# EAGLE design Iridium_9603_Lite_USB (EAGLE 7.6.0)
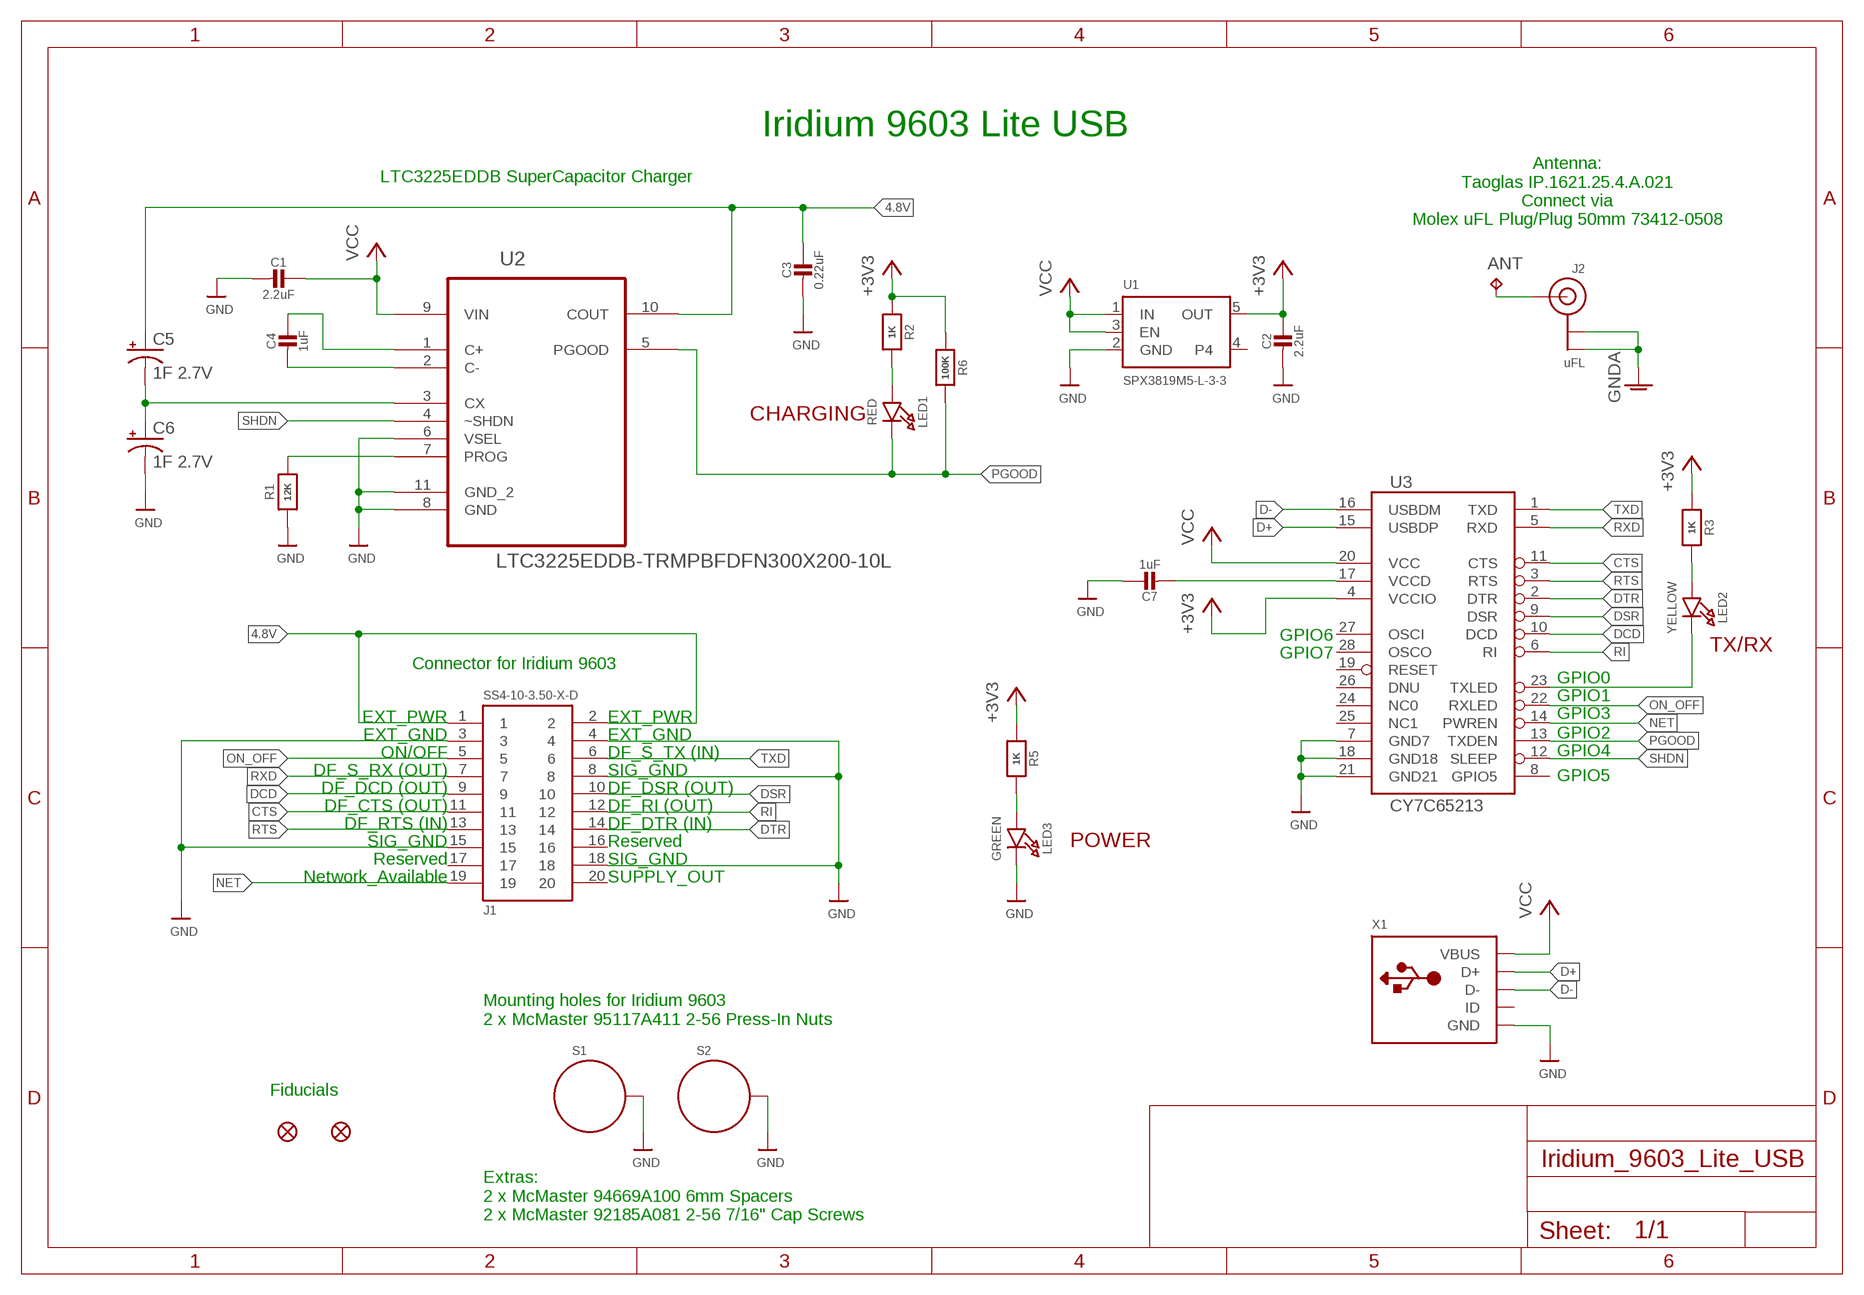
[diagram p0: schematic, sheet 1]

## Parts
ANT  TPB2,54  [B2,54]
C1  2.2uF  CAP_CERAMIC0805-NOOUTLINE  [0805-NO]
C2  2.2uF  CAP_CERAMIC0805-NOOUTLINE  [0805-NO]
C3  0.22uF  CAP_CERAMIC0603_NO  [0603-NO]
C4  1uF  CAP_CERAMIC0603_NO  [0603-NO]
C5  1F 2.7V  1F-2.7V(PTH)CPOL-RADIAL-1H-2.7V  [CPOL-RADIAL-1F-2.7V]
C6  1F 2.7V  1F-2.7V(PTH)CPOL-RADIAL-1H-2.7V  [CPOL-RADIAL-1F-2.7V]
C7  1uF  CAP_CERAMIC0603_NO  [0603-NO]
FD1  FIDUCIAL1X2  [FIDUCIAL-1X2]
FD2  FIDUCIAL1X2  [FIDUCIAL-1X2]
J1  SS4-10-3.50-X-D  [SS4-10-3.50-X-D]
J2  uFL  ANTENNA_U.FL  [U.FL]
LED1  RED  LED0805_NOOUTLINE  [CHIPLED_0805_NOOUTLINE]
LED2  YELLOW  LED0805_NOOUTLINE  [CHIPLED_0805_NOOUTLINE]
LED3  GREEN  LED0805_NOOUTLINE  [CHIPLED_0805_NOOUTLINE]
R1  12K  RESISTOR0805_NOOUTLINE  [0805-NO]
R2  1K  RESISTOR_0603_NOOUT  [0603-NO]
R3  1K  RESISTOR_0603_NOOUT  [0603-NO]
R5  1K  RESISTOR_0603_NOOUT  [0603-NO]
R6  100K  RESISTOR_0603_NOOUT  [0603-NO]
S1  STANDOFF_ELECTRICALMCMASTER-95117A411  [STANDOFF-ELECTRICAL-MCMASTER-95117A411]
S2  STANDOFF_ELECTRICALMCMASTER-95117A411  [STANDOFF-ELECTRICAL-MCMASTER-95117A411]
U1  SPX3819M5-L-3-3  VREG_SOT23-5  [SOT23-5]
U2  LTC3225EDDB-TRMPBFDFN300X200-10L  [DFN300X200-10L]
U3  CY7C65213  [SSOP28DB]
X1  USBFCI_10103594_MILL  [FCI_10103594_MILL]

## Nets
4.8V: C3.1 C5.+ J1.1 J1.2 U2.10(COUT)
+3V3: C2.1 R2.1 R3.1 R5.1 R6.1 U1.5(OUT) U3.4(VCCIO)
ANT: ANT.TP J2.3(SIGNAL)
CTS: J1.11 U3.11(CTS)
D+: U3.15(USBDP) X1.D+
D-: U3.16(USBDM) X1.D-
DCD: J1.9 U3.10(DCD)
DSR: J1.10 U3.9(DSR)
DTR: J1.14 U3.2(DTR)
GND: C1.2 C2.2 C3.2 C6.- C7.1 J1.3 J1.4 J1.8 J1.15 J1.18 LED3.C R1.1 S1.P1 S2.P1 U1.2(GND) U2.6(VSEL) U2.8(GND) U2.11(GND_2) U3.7(GND7) U3.18(GND18) U3.21(GND21) X1.BASE@1(GND) X1.BASE@2(GND) X1.GND X1.SPRT@1(GND) X1.SPRT@2(GND) X1.SPRT@3(GND) X1.SPRT@4(GND)
GNDA: J2.1(GND) J2.2(GND)
N$1: LED2.A R3.2
N$2: C7.2 U3.17(VCCD)
N$3: LED1.A R2.2
N$5: LED2.C U3.23(TXLED)
N$6: C5.- C6.+ U2.3(CX)
N$8: LED3.A R5.2
N$9: C4.2 U2.2(C-)
N$10: C4.1 U2.1(C+)
N$11: R1.2 U2.7(PROG)
NET: J1.19 U3.14(PWREN)
ON_OFF: J1.5 U3.22(RXLED)
PGOOD: LED1.C R6.2 U2.5(PGOOD) U3.13(TXDEN)
RI: J1.12 U3.6(RI)
RTS: J1.13 U3.3(RTS)
RXD: J1.7 U3.5(RXD)
SHDN: U2.4(~SHDN) U3.12(SLEEP)
TXD: J1.6 U3.1(TXD)
VCC: C1.1 U1.1(IN) U1.3(EN) U2.9(VIN) U3.20(VCC) X1.VBUS
Unconnected: J1.16 J1.17 J1.20 U1.4 U3.8(GPIO5) U3.19(RESET) U3.24(NC0) U3.26(DNU) U3.27(OSCI) U3.28(OSCO) X1.ID

## Notes on the sheet
- Iridium 9603 Lite USB
- LTC3225EDDB SuperCapacitor Charger
- Antenna:
  Taoglas IP.1621.25.4.A.021
  Connect via
  Molex uFL Plug/Plug 50mm 73412-0508
- CHARGING
- GPIO6
- TX/RX
- GPIO7
- Connector for Iridium 9603
- GPIO0
- GPIO1
- EXT_PWR | EXT_PWR | GPIO3
- EXT_GND | EXT_GND | GPIO2
- ON/OFF | DF_S_TX (IN) | GPIO4
- DF_S_RX (OUT) | SIG_GND
- GPIO5
- DF_DCD (OUT) | DF_DSR (OUT)
- DF_CTS (OUT) | DF_RI (OUT)
- DF_RTS (IN) | DF_DTR (IN)
- SIG_GND | Reserved | POWER
- Reserved | SIG_GND
- Network_Available | SUPPLY_OUT
- Mounting holes for Iridium 9603
  2 x McMaster 95117A411 2-56 Press-In Nuts
- Fiducials
- Extras:
  2 x McMaster 94669A100 6mm Spacers
  2 x McMaster 92185A081 2-56 7/16" Cap Screws

## Power pins joined to a net without a drawn wire
NC1: U3.25(NC1)

## Library data of the parts
ANT = testpad:TP: Test pad
C1-C4 C7 = microbuilder:CAP_CERAMIC: Ceramic Capacitors For new designs, use the packages preceded by an '_' character since they are more reliable: The following footprints should be used on most boards: _0402 - Standard footprint for regular board layouts _0603 - Standard footprint for regular board layouts _0805 - Standard footprint for regular board layouts _1206 - Standard footprint for regular board layouts For extremely tight-pitch boards where space is at a premium, the following 'micro-pitch' footprints can be used (smaller pads, no silkscreen outline, etc.): _0402MP - Micro-pitch footprint for very dense/compact boards _0603MP - Micro-pitch footprint for very dense/compact boards _0805MP - Micro-pitch footprint for very dense/compact boards _1206MP - Micro-pitch footprint for very dense/compact boards
C5 C6 = SparkFun-Capacitors:1F-2.7V(PTH): CAP-08070
FD1 FD2 = SparkFun-Aesthetics:FIDUCIAL: Fiducial Alignment Points Various fiducial points for machine vision alignment.
J1 = SS4-10-3.50-X-D:SS4-10-3.50-X-D: 0.4mm[.016] SOCKET STRIP ASSEMBLY.
J2 = microbuilder:ANTENNA_U.FL: U.FL Antenna Connector
LED1-LED3 = microbuilder:LED: LED 0603 - 0603 Surface Mount Package 2mA: Green LED - Low Power (3.9mcd, 2ma, 1.7Vf) - Digikey: 475-2709-2-ND Orange LED - Low Power (9.8mcd, 2ma, 1.8Vf) - Digikey: 475-1194-2-ND Red LED - Low Power (5mcd, 2ma, 1.8Vf) - Digikey: 475-1195-2-ND Yellow LED - Low Power (7mcd, 2ma, 1.8Vf) - Digikey: 475-1196-2-ND 5mA: Blue LED - Low Power (17mcd, 5ma, 2.9Vf) - Digikey: LNJ937W8CRACT-ND 0805 - 0805 Surface Mount Package 2mA: Red LED (8.8mcd, 2mA, 1.8Vf, Clear) - Low Power [Digikey: 475-2510-1-ND] Green LED (5mcd, 2mA, 1.8Vf, Clear) - Low Power [Digikey: 475-2730-1-ND] Yellow LED (11.3mcd, 2mA, 1.8Vf, Clear) - Low Power [Digikey: 475-2555-1-ND] 20mA: Red LED (104mcd, 20mA, Diffused) - LS R976 [Digikey: 475-1278-6-ND] Red LED (12mcd, 20mA, 2.0Vf, Clear) - APT2012EC [Digikey: 754-1128-1-ND] Green LED (15mcd, 20mA, 2.2Vf, Clear) - APT2012GC [Digikey: 754-1131-1-ND] Orange LED (160mcd, 20mA, 2.1Vf, Clear) - APT2012SECK [Digikey: 754-1130-1-ND] 1206 - 1206 Surface Mount Package Green LED (26mcd, 20mA, Diffused) - LG N971 [Digikey: 475-1407-6-ND] Red LED (15mcd, 20mA, Diffused) - LH N974 [Digikey: 475-1416-6-ND] Cree - Cree High-Power Surface Mount LEDs XPEBWT-L1-0000-00D50 - White 111lm 350mA 2.9Vf 6200K 110° XTEAWT-00-0000-00000LEE3 - White 114lm 350mA 2.85Vf 5000K 115° Everlight - Everlight 45-21 Series Surface Mount LEDs 45-21/QK2C-B2832AC2CB2/2T - Warm White 2000mcd 20mA 3.25Vf 3050K 120° 45-21/LK2C-B38452C4CB2/2T - Nuetral White 2000mcd 20mA 3.25Vf 4150K 120° 45-21/LK2C-B50634C6CB2/2T - Cold White 2200mcd 20mA 3.25Vf 5650K 120° PLCC2 Reverse Mount LS T77K-J1L2-1-0-2-R18-Z - Red 11.25mcd 2mA 1.8Vf 630nm 120° LO T77K-L1M2-24-Z - Orange 19.6mcd 2mA 1.8Vf 606nm 120° LY T77K-K2M1-26-Z - Yellow 15.7mcd 2mA 1.8Vf 587nm 120°
R1-R3 R5 R6 = microbuilder:RESISTOR: Resistors For new designs, use the packages preceded by an '_' character since they are more reliable: The following footprints should be used on most boards: _0402 - Standard footprint for regular board layouts _0603 - Standard footprint for regular board layouts _0805 - Standard footprint for regular board layouts _1206 - Standard footprint for regular board layouts For extremely tight-pitch boards where space is at a premium, the following 'micro-pitch' footprints can be used (smaller pads, no silkscreen outline, etc.): _0402MP - Micro-pitch footprint for very dense/compact boards _0603MP - Micro-pitch footprint for very dense/compact boards _0805MP - Micro-pitch footprint for very dense/compact boards _1206MP - Micro-pitch footprint for very dense/compact boards
S1 S2 = SparkFun-Electromechanical:STANDOFF_ELECTRICAL: A standoff intended to be an electrically connected point.
U1 = microbuilder:VREG_SOT23-5: SOT23-5 Fixed Voltage Regulators Part Current Out V Out V In V Dropout ?JA (°C/W) TJ (°C) Digikey Part No. ADP121 150mA 3.3V 3.4-5.5V 0.09V @ 150mA -- -- ADP121-AUJZ33R7CT-ND ADP121 150mA 3.0V 3.1-5.5V 0.09V @ 150mA -- -- ADP121-AUJZ30R7CT-ND ADP122 300mA 3.3V 3.4-5.5V 0.085V @ 300mA -- -- ADP122AUJZ-3.3-R7CT-ND ADP1712 300mA 3.3V 3.5-5.5V 0.17V @ 300mA -- -- ADP1712AUJZ-3.3-R7TR-ND AP7311 (Low Cost) 150mA 3.3V 3.5-6V 0.15V @ 150mA -- -- AP7311-33WG-7DICT-ND LD39015M18R 150mA 1.8V 1.9V-5.5V 0.08V @ 100mA -- -- 497-6977-1-ND LP2985A-33DBVR 150mA 3.3V 3.3-16V 0.28V @ 150mA 206 150 296-18479-1-ND MCP1824T-3302E/OT 300mA 3.3V 3.5V-6V 0.2V @ 300mA -- -- MCP1824T-3302E/OTCT-ND MIC5205-2.5YM5 TR 150mA 2.5V 2.7-16V 0.165V @ 150mA -- -- 576-1257-2-ND MIC5205-3.0YM5 TR 150mA 3.0V 3.2V-16V 0.165V @ 150mA -- -- 576-1258-2-ND MIC5205-3.3YM5 TR 150mA 3.3V 3.5V-16V 0.165V @ 150mA -- -- 576-1259-2-ND TPS780330220 150mA 3.3V+2.2V 3.6-5.5V 250mV Max -- -- 296-23332-1-ND TDA3663/N1,135 100mA 3.3V 3.5-45V 0.18V @ 50mA -- -- 568-5343-1-ND Max operating temp can be calculated using ?JA, TJ (max junction temperature), and power in watts. Set the "Maximum Ambient Temperature" until it reaches TJ ("Max Junction Temperature"), which is the absolute limit for safe use of the regulator: Heat Sink Temperature Calculator <http://www.daycounter.com/Calculators/Heat-Sink-Temperature-Calculator.phtml> For example, With 12V source into a 3.3V LP2985 and a 30mA load, we are dissipating (12V-3.3V) * 0.03A = 0.261W. With a ?JA of 206 °C/W, a TJ of 150°C, and 261mW we can safely use the chip without a heat sink up to 75°C (=147.1°C Junction Temperature).
U2 = LTC_By_element14_Batch_1:LTC3225EDDB-TRMPBF: 150mA Supercapacitor Charger
U3 = SparkFun-DigitalIC:CY7C65213: USB UART CY7C65213 USB-UART controller.; PROD_ID: IC-12487
X1 = microbuilder:USB: USB Connectors USBMINIB - Surface Mount Female Mini-B USB Connector 4UConnector: 06564

## Board
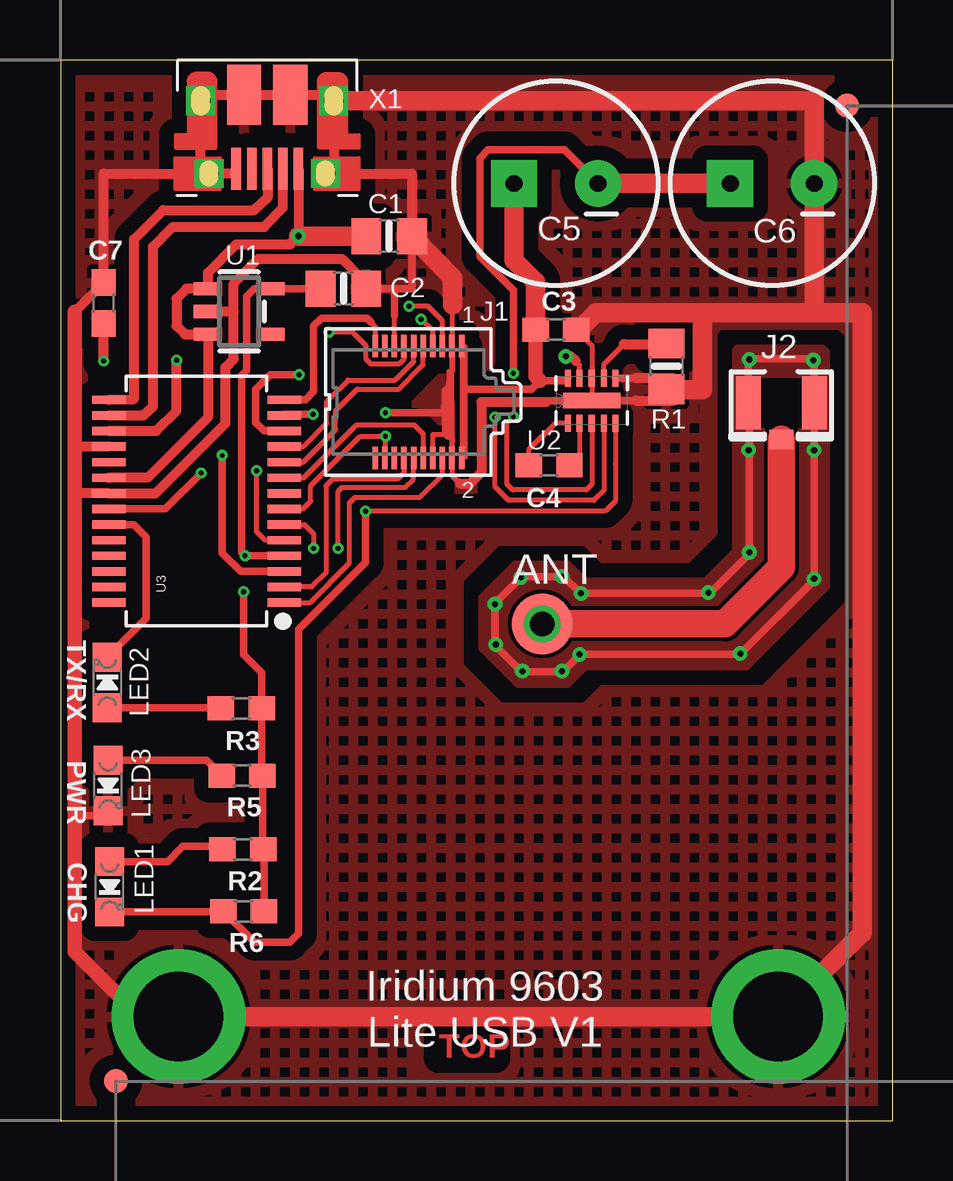
[diagram p1: board, top side]
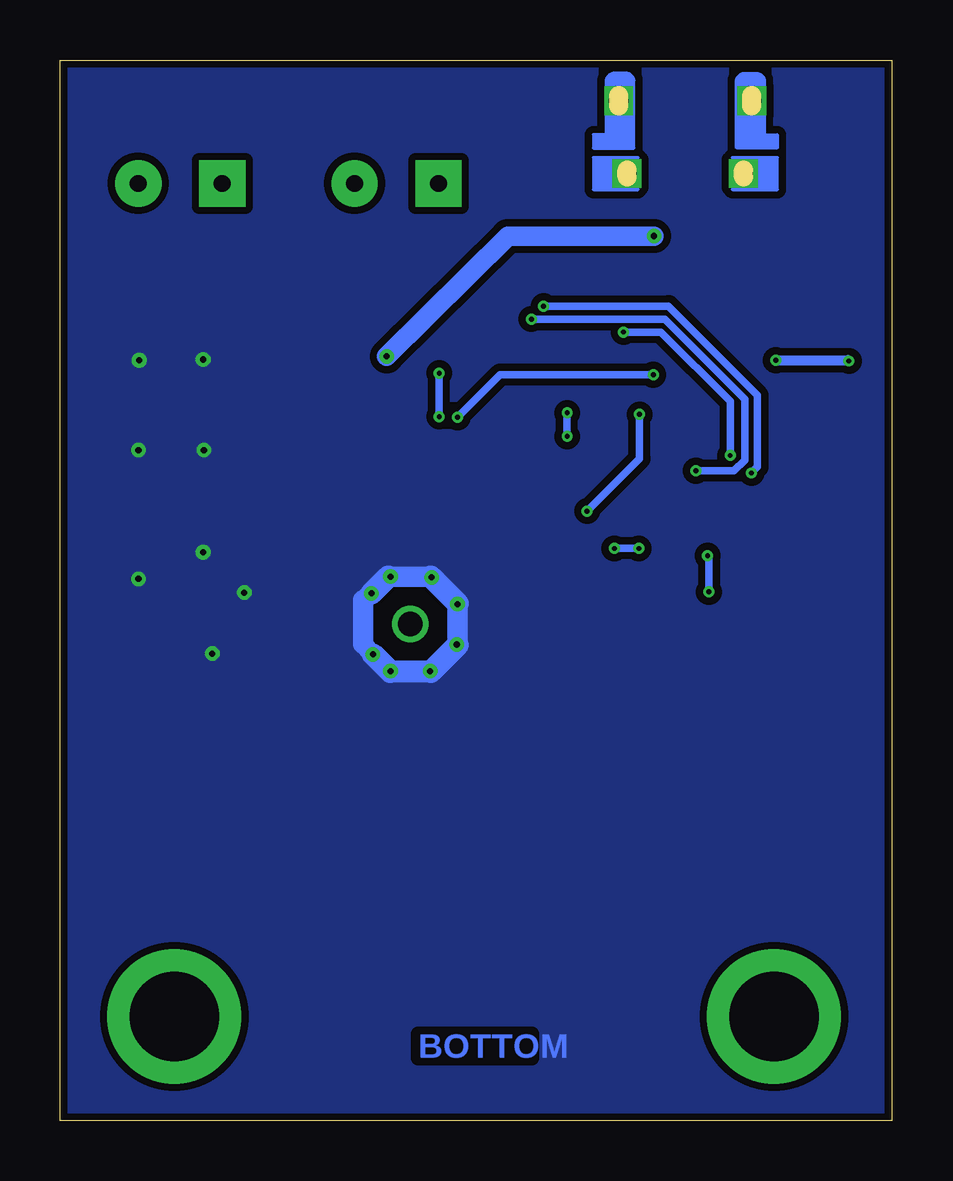
[diagram p2: board, bottom side, seen from below]

Size 34.67 x 44.2 mm. Coordinates in mm from the lower left corner, seen from the top.
Outline: 0,0 34.67,0 34.67,44.2 0,44.2 0,0
Copper layers (1*16): Top 0.018mm / dielectric 1.55mm / Bottom 0.018mm
Design rules "Multi-CB_2L_125um-Tracks_OL35um": minimum track width 0.125mm, minimum drill 0.2mm, track to track 0.125mm, track to pad 0.125mm, pad to pad 0.125mm, via to via 0.125mm, smd to smd 0mil, copper to edge 0.2mm, drill to drill 0.2mm, minimum pad ring 0.125mm, minimum via ring 0.125mm, stop-mask expansion 2mil, vias tented up to drill 0.45mm, thermal gap 0.2mm
bRestrict: area 19.3,19.9 to 20.8,21.5

### Footprints (pad centres in the part's own frame; a part is rotated, then mirrored left to right if it is on the bottom)
B2,54 = smd 2.54 x 2.54: TP 0,0
0805-NO = smd 1.24 x 1.5: 1 -0.95,0; 2 0.95,0
0603-NO = smd 1.1 x 1: 1 -0.85,0; 2 0.85,0
CPOL-RADIAL-1F-2.7V = drill 0.7 pad 1.93 square: + 1.75,0 | drill 0.7 pad 1.93: - -1.75,0
FIDUCIAL-1X2 = smd 1 x 1: 1 0,0
SS4-10-3.50-X-D = smd 0.23 x 0.93: 1 1.8,2.335; 2 1.8,-2.335; 3 1.4,2.335; 4 1.4,-2.335; 5 1,2.335; 6 1,-2.335; 7 0.6,2.335; 8 0.6,-2.335; 9 0.2,2.335; 10 0.2,-2.335; 11 -0.2,2.335; 12 -0.2,-2.335; 13 -0.6,2.335; 14 -0.6,-2.335; 15 -1,2.335; 16 -1,-2.335; 17 -1.4,2.335; 18 -1.4,-2.335; 19 -1.8,2.335; 20 -1.8,-2.335
U.FL = smd 2.2 x 1.05: 1 0,1.375; 2 0,-1.375 | smd 0.8 x 1: 3 1.525,0
CHIPLED_0805_NOOUTLINE = smd 1.2 x 1.2: A 0,-1.05; C 0,1.05
STANDOFF-ELECTRICAL-MCMASTER-95117A411 = drill 3.734 pad 5.588: P1 0,0
SOT23-5 = smd 0.55 x 1.2: 1 -0.95,-1.3; 2 0,-1.3; 3 0.95,-1.3; 4 0.95,1.3; 5 -0.95,1.3
DFN300X200-10L = smd 0.711 x 0.254: 1 -0.94,0.991; 2 -0.94,0.508; 3 -0.94,0; 4 -0.94,-0.508; 5 -0.94,-0.991; 6 0.94,-0.991; 7 0.94,-0.508; 8 0.94,0; 9 0.94,0.508; 10 0.94,0.991 | smd 0.635 x 2.388: 11 0,0
SSOP28DB = smd 0.348 x 1.397: 1 -4.225,-3.656; 2 -3.575,-3.656; 3 -2.925,-3.656; 4 -2.275,-3.656; 5 -1.625,-3.656; 6 -0.975,-3.656; 7 -0.325,-3.656; 8 0.325,-3.656; 9 0.975,-3.656; 10 1.625,-3.656; 11 2.275,-3.656; 12 2.925,-3.656; 13 3.575,-3.656; 14 4.225,-3.656; 15 4.225,3.656; 16 3.575,3.656; 17 2.925,3.656; 18 2.275,3.656; 19 1.625,3.656; 20 0.975,3.656; 21 0.325,3.656; 22 -0.325,3.656; 23 -0.975,3.656; 24 -1.625,3.656; 25 -2.275,3.656; 26 -2.925,3.656; 27 -3.575,3.656; 28 -4.225,3.656
FCI_10103594_MILL = smd 1.425 x 2.5: BASE@1 -0.963,1.45; BASE@2 0.963,1.45 | smd 0.4 x 1.75: D+ 0,4.525; D- -0.65,4.525; GND 1.3,4.525; ID 0.65,4.525; VBUS -1.3,4.525 | drill 0.8 pad 1.016 square: SPRT@1 -2.775,1.7; SPRT@2 2.775,1.7; SPRT@3 -2.426,4.73; SPRT@4 2.426,4.73

### Placement (x,y rotation side)
ANT  20.07,20.7 0 top
C1  13.68,36.86 0 top
C2  11.78,34.67 0 top
C3  20.64,32.96 0 top
C4  20.35,27.3 0 top
C5  20.64,39.05 180 top
C6  29.65,39.05 180 top
C7  1.78,34.07 270 top
FD1  2.29,1.65 0 top
FD2  32.77,42.29 0 top
J1  14.9,29.94 0 top
J2  30.04,29.91 270 top
LED1  2.03,9.75 180 top
LED2  1.94,18.26 0 top
LED3  1.97,13.97 180 top
R1  25.24,31.43 90 top
R2  7.59,11.3 180 top
R3  7.52,17.18 180 top
R5  7.56,14.38 180 top
R6  7.62,8.73 180 top
S1  4.9,4.34 0 top
S2  29.9,4.34 0 top
U1  7.43,33.72 270 top
U2  22.13,30 90 top
U3  5.65,25.81 90 top
X1  8.6,44.2 180 top

### Tracks (layer width: path | path; a pad name or v marks a point on that pad's centre or on a via)
4.8V
  Top 0.127: 16.7,32.26 16.83,32.26 16.83,27.61 J1.2 J1.1 16.89,32.28 16.89,30.48 16.89,27.62 16.76,27.62
  Top 0.203: 16.83,32.26 16.83,31.2
  Top 0.305: 16.89,30.48 19.62,30.48 19.97,30.83 21.02,30.83 U2.10
  Top 0.61: 19.97,30.83 19.79,31.01 C3.1
  Top 0.813: C3.1 19.79,34.95 18.89,35.85 C5.+
+3V3  (via drill 0.2 pad 0.46)
  Top 0.305: U1.5 C2.1 8.06,34.67 7.75,34.35 7.75,31.27 7.53,31.05 7.53,23.69 v7.67,23.54 U3.4 | v7.62,22.04 7.62,19.42 8.38,18.67 R3.1 8.38,14.41 R5.1 8.41,11.34 R2.1 8.47,11.3 R6.1
  Bottom 0.305: v7.67,23.54 7.62,23.48 v7.62,22.04
ANT  (via drill 1.02 pad 1.4)
  Top 1.143: J2.3 30.04,23.05 27.69,20.7 ANT.TP
  other vias: 20.07,20.7
CTS
  Top 0.203: U3.11 10.12,28.09 11.08,29.05 11.08,29.97 11.97,30.86 13.94,30.86 14.71,31.63 J1.11
D+
  Top 0.406: U3.15 3.05,30.07 3.05,36.73 4.25,37.94 8.06,37.94 8.64,38.48 8.64,39.64 X1.D+
D-
  Top 0.406: U3.16 3.45,29.39 3.84,29.75 3.84,36.42 4.67,37.24 8.48,37.24 9.25,38.05 X1.D-
DCD
  Top 0.203: U3.10 10.1,27.44 11.46,28.8 11.46,29.59 12.35,30.48 14.1,30.48 15.11,31.49 J1.9
DSR
  Top 0.203: U3.9 10.12,26.79 12.32,28.99 14.73,28.99 15.11,28.61 J1.10
DTR
  Top 0.203: J1.14 14.3,27 14.03,26.73 11.34,26.73 11.05,26.45 11.05,22.83 10.46,22.24 U3.2
GND  (via drill 0.2 pad 0.46)
  Top 0.127: J1.4 16.32,27.61 | J1.15 | J1.18 13.53,27.61 | J1.8 | 23.97,30.94 23.97,30.96 | 20.23,30 20.23,29.94
  Top 0.203: J1.4 J1.3 16.32,32.12 | U2.11 U2.8 22.13,32.31 21.54,32.9 C3.2 | 16.32,32.12 16.32,31.21 16.16,31.21 16.16,30.83 | 16.16,30.67 16.16,28.48 | 16.16,28.48 16.32,28.48 16.29,27.53 | 16.3,29.94 J1.4 | 16.32,32.12 16.32,34 | J1.4 16.3,26.88 16.64,26.54 | 16,28.6 16,29.78 16,30.48 16.13,30.61 16.13,30.64 16.16,30.67 | 16,28.6 16.12,28.48 16.16,28.48 | 16.16,30.67 16.16,30.83 | 16.16,30.83 16.22,30.77 16.26,30.77 | J1.15 13.9,33.53 | 13.53,27.61 v13.53,28.51 12.48,28.51 10.41,26.45 10.41,25.81 10.09,25.49 U3.7 | J1.8 15.51,28.6 16,28.6 | 13.49,27.6 J1.18
  Top 0.305: U2.6 23.97,30.94 | 23.97,30 U2.11 20.23,30 | C3.2 21.24,32.96 | 13.9,33.53 13.9,34.67 | 13.9,34.67 C2.2 | 13.9,34.67 14.63,34.67 C1.2 | 0.57,13.46 0.57,13.08 | v13.53,29.5 16,29.5 16,29.78 | 0.57,16 0.57,16.51 | LED3.C 1.75,12.7 0.57,12.7
  Top 0.406: 23.97,30.96 25.5,30.96 R1.1 25.56,30 23.97,30 | 20.23,29.94 17.53,29.94 17.53,27.02 17.05,26.54 16.64,26.54 | X1.GND 7.3,39.47 X1.SPRT@4 | X1.SPRT@4 5.83,39.47 X1.SPRT@2 5.83,42.75 X1.BASE@2 X1.BASE@1 11.38,42.75 X1.SPRT@1 11.38,39.47 X1.SPRT@3 14.63,39.47 C1.2 | X1.SPRT@4 1.78,39.47 C7.1 0.57,33.71 | 0.57,26.29 0.72,26.14 U3.21 3.94,26.14 6.86,29.05 6.86,31.4 7.21,31.75 7.21,33.72 | U3.18 0.62,28.09 0.57,28.04 | 7.21,33.72 7.21,34.89 8.22,35.91 11.72,35.91 12.48,35.15 12.48,34.7 12.45,34.67 | U1.2 7.21,33.72
  Top 0.61: 0.57,33.71 0.57,28.04 0.57,26.29 0.57,16.51 0.57,13.08 0.57,12.7 0.57,7.05 3.33,4.29 4.92,4.29
  Top 0.813: R1.1 26,30.45 26.73,30.45 26.73,33.59 | C6.- 31.41,42.5 X1.SPRT@1 | 21.54,32.9 22.3,33.66 31.4,33.66 | 16.32,34 16.32,35.12 C1.2 | S1.P1 S2.P1 33.4,7.84 33.4,33.66 31.4,33.66 | 31.4,33.66 31.4,39.02
  Bottom 0.305: v13.53,28.51 v13.53,29.5
  pour Top (isolate 0.61, rank 2, hatched): 0.38,0.38 0.38,43.81 34.29,43.81 34.29,0.38
GNDA  (via drill 0.25 pad 0.61)
  Top 0.305: 28.7,29.91 28.7,23.62 27.05,21.97 v21.68,21.97 20.92,22.67 19.21,22.67 18.1,21.56 18.1,19.81 19.21,18.7 20.92,18.7 21.65,19.43 | 21.65,19.43 28.32,19.43 | J2.1 31.41,22.52 v28.32,19.46 | J2.2 28.66,31.75 31.4,31.75 31.4,29.84 | 21.65,19.43 21.68,19.46
  Top 0.813: J2.2 28.7,29.91
  Bottom 0.813: v21.68,21.97 22.04,21.68 | 22.04,19.88 21.65,19.43
  Bottom 0.864: 20.99,22.67 19.21,22.67 | 18.1,21.56 18.1,19.81 | 22.04,21.68 22.04,19.88
  Bottom 0.914: v21.68,21.97 20.99,22.67 | 19.21,22.67 18.1,21.56 | 18.1,19.81 19.21,18.7 20.89,18.7 v21.62,19.43
  other vias: 28.7,31.72 31.37,31.69 28.7,23.69 31.4,22.57 26.99,22 20.89,18.73 19.24,18.73 18.13,19.84 18.1,21.53 19.18,22.64 20.89,22.67 28.67,27.94 31.4,27.94
  pour Bottom (isolate 0.305, no thermals): 0.38,0.38 0.38,43.81 34.29,43.81 34.29,0.38
  pour Top (isolate 0.16, no thermals): 26.86,22.48 28.13,23.75 28.13,32.13 28.19,32.19 31.75,32.19 31.91,32.04 31.91,22.26 28.57,18.92 21.84,18.92 21.11,18.19 19.05,18.19 17.56,19.68 17.56,21.81 18.92,23.18 21.15,23.18 21.84,22.48
N$1
  Top 0.305: R3.2 6.64,17.21 LED2.A
N$2  (via drill 0.2 pad 0.46)
  Top 0.406: U3.17 3.97,28.74 4.83,29.59 v4.83,31.69 | v1.78,31.66 C7.2
  Bottom 0.406: v4.83,31.69 1.81,31.69 v1.78,31.66
N$3
  Top 0.305: R2.2 6.61,11.43 5.08,11.43 4.45,10.8 LED1.A
N$5
  Top 0.305: U3.23 3.04,24.84 3.56,24.32 3.56,20.93 LED2.C
N$6  (via drill 0.2 pad 0.46)
  Top 0.203: U2.3 22.13,26.51 21.91,26.29 18.83,26.29 18.61,26.51 18.61,29.08 v18.86,29.34
  Top 0.305: v18.86,31.15 18.86,34.61 17.46,36.01 17.46,40.1 17.81,40.45 20.99,40.45 C5.-
  Top 0.813: C6.+ C5.-
  Bottom 0.305: v18.86,29.34 v18.86,31.15
N$8
  Top 0.305: R5.2 6.07,15.02 LED3.A
N$9
  Top 0.203: U2.2 21.62,27.73 C4.2
N$10
  Top 0.203: U2.1 20.62,29.06 19.5,27.95 C4.1
N$11
  Top 0.203: U2.7 22.64,31.53 23.46,32.35
  Top 0.406: 23.46,32.35 24.7,32.35 R1.2
NET
  Top 0.203: 13.11,32.62 J1.19 13.11,33.09 12.92,33.27
  Top 0.305: U3.14 10.19,30.04 10.54,30.39 10.54,33.12 10.86,33.43 12.76,33.43 12.92,33.27
ON_OFF  (via drill 0.2 pad 0.46)
  Top 0.203: J1.5 15.9,33.34 15.3,33.94 v14.51,33.94
  Top 0.305: v5.84,26.99 4.34,25.49 U3.22
  Bottom 0.305: v14.51,33.94 9.3,33.94 5.59,30.23 5.59,27.24 v5.84,26.99
PGOOD  (via drill 0.2 pad 0.46)
  Top 0.203: U2.5 23.12,28.5 23.11,27.37 23.11,25.81 22.7,25.4 v12.7,25.4
  Top 0.305: v10.51,29.43 9.31,29.43 U3.13 | v12.7,25.4 12.7,23.27 9.91,20.48 9.91,7.81 9.53,7.43 8.07,7.43 R6.2 6.74,8.7 LED1.C
  Bottom 0.305: v10.51,29.43 10.51,27.59 v12.7,25.4
RI  (via drill 0.2 pad 0.46)
  Top 0.203: v11.56,23.84 11.56,26.23 11.72,26.38 14.35,26.38 14.7,26.73 J1.12 | U3.6 10.15,24.84 10.54,24.45 v10.54,23.84
  Bottom 0.305: v10.54,23.84 v11.56,23.84
RTS  (via drill 0.2 pad 0.46)
  Top 0.203: J1.13 14.3,31.73 14.1,31.53 12.92,31.53 12.73,31.72 12.73,32.29 12.16,32.86 v11.18,32.86
  Top 0.305: v6.73,27.72 6.73,23.65 7.5,22.89 U3.3
  Bottom 0.305: v6.73,27.72 6.73,29.97 9.62,32.86 v11.18,32.86
RXD  (via drill 0.2 pad 0.46)
  Top 0.203: J1.7 15.51,32.91 v15.02,33.4 | U3.5 8.51,24.19 8.16,24.54 v8.16,27.08
  Bottom 0.305: v15.02,33.4 9.46,33.4 6.13,30.07 6.13,27.53 6.57,27.08 v8.16,27.08
SHDN  (via drill 0.2 pad 0.46)
  Top 0.203: U2.4 22.64,26.26 22.23,25.84 18.67,25.84 18.1,26.42 v18.1,29.3
  Top 0.305: U3.12 8.47,28.74 8.13,29.08 8.13,30.48 8.73,31.08 v9.94,31.08
  Bottom 0.305: v9.94,31.08 16.32,31.08 v18.1,29.3
TXD
  Top 0.203: U3.1 10.38,21.59 12.03,23.24 12.03,25.75 12.26,25.97 14.95,25.97 15.9,26.92 J1.6
VCC  (via drill 0.25 pad 0.61)
  Top 0.203: U2.9 21.62,31.5 21.46,31.66
  Top 0.406: 21.46,31.66 21.27,31.84 v21.05,31.84 | X1.VBUS v9.91,36.86 9.56,36.51 7.3,36.51 6.13,35.34 U1.1 5.24,34.67 4.83,34.26 4.83,33.12 5.17,32.77 5.18,32.77 U1.3 6.13,29.31 3.62,26.8 U3.20
  Top 0.813: C1.1 v9.91,36.86
  Bottom 0.813: v21.05,31.84 16,36.86 v9.91,36.86

### Text on the board
Top: TOP
Bottom: BOTTOM
tPlace: TX/RX | PWR | CHG | Iridium 9603 / Lite USB V1